# EAGLE design untitled (EAGLE 9.6.2)
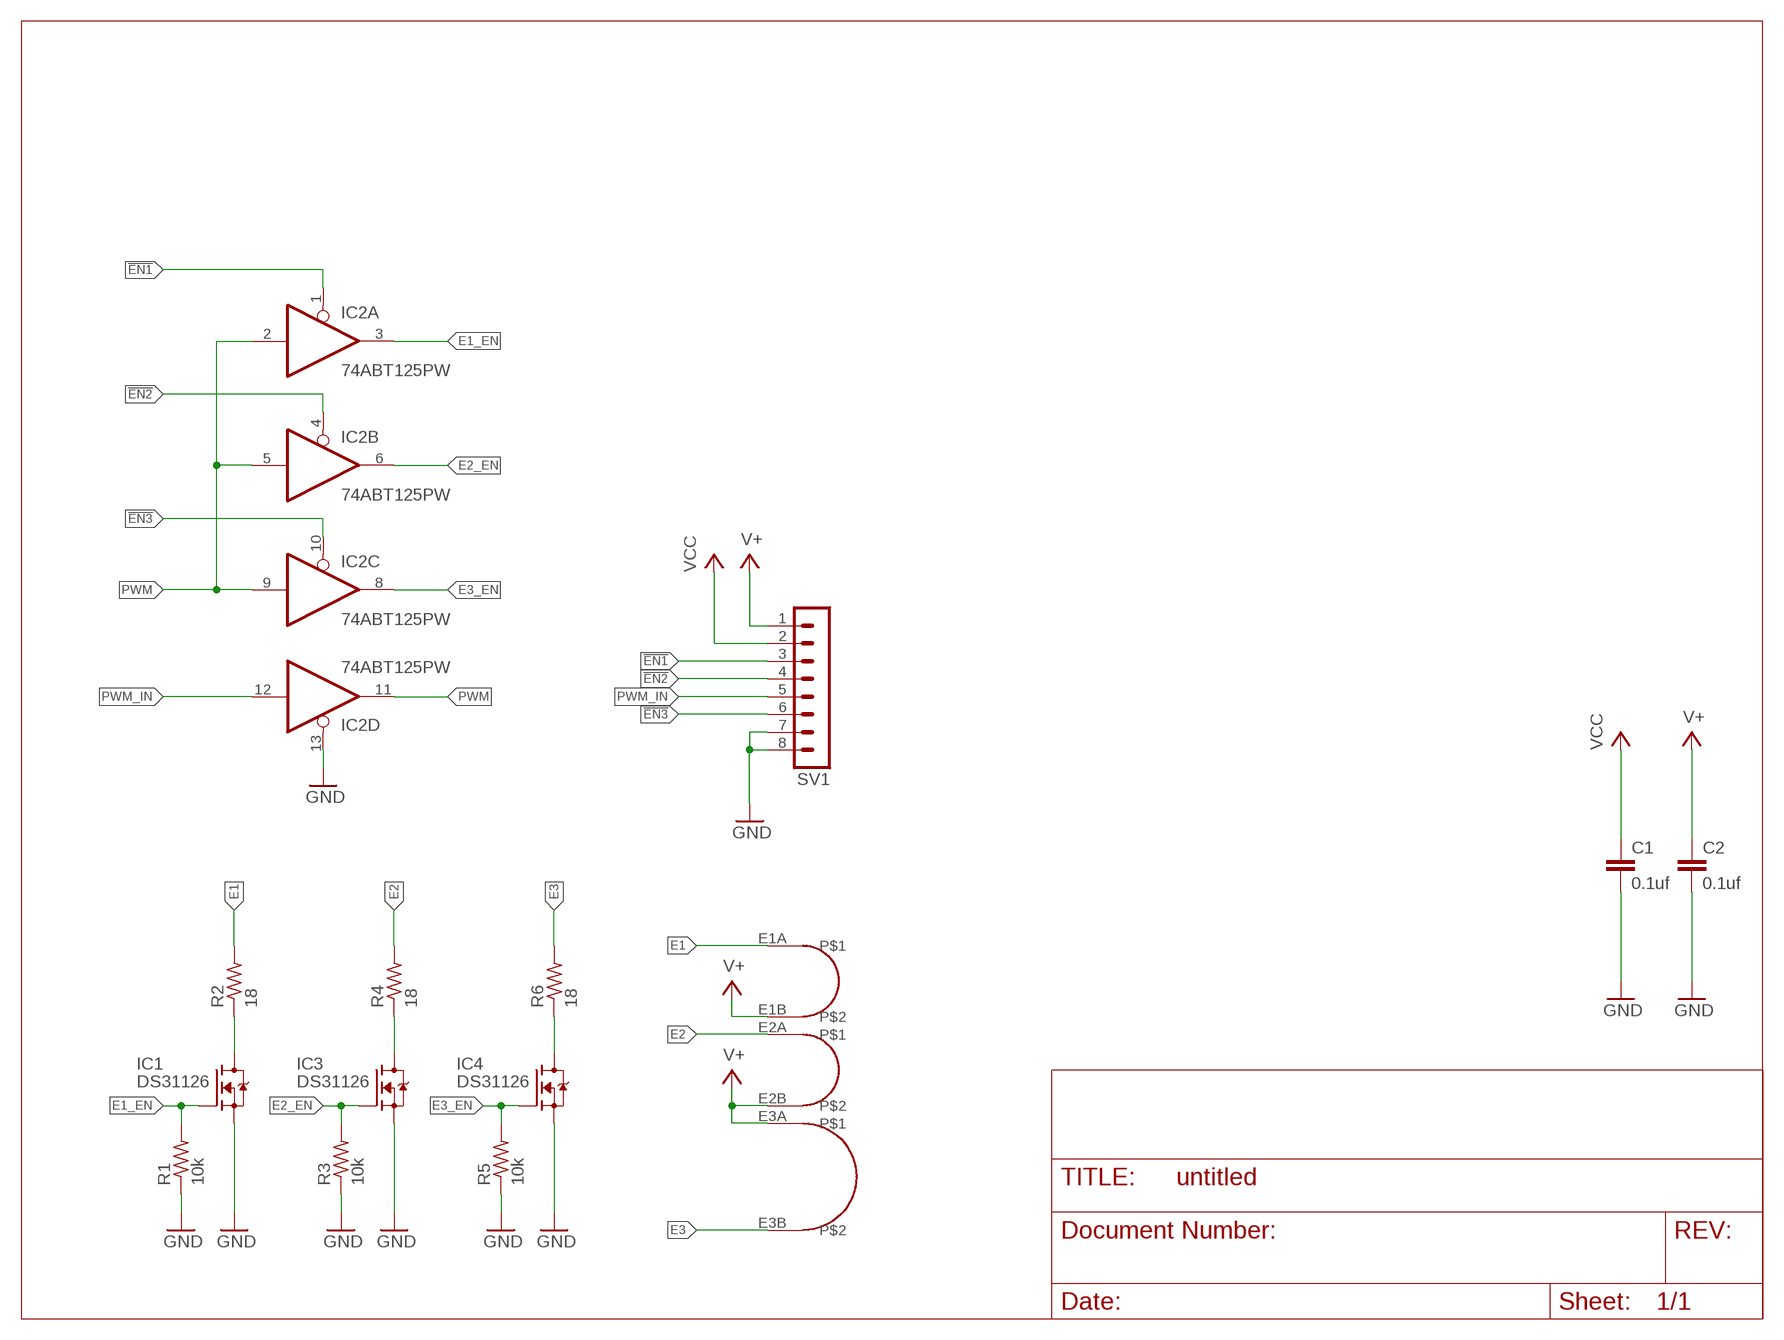
[diagram p0: schematic, sheet 1]

## Parts
C1  0.1uf  C-EUC0603  [C0603]
C2  0.1uf  C-EUC0603  [C0603]
IC1  DS31126  [SOT23]
IC2  74ABT125PW  [TSSOP14]
IC3  DS31126  [SOT23]
IC4  DS31126  [SOT23]
NICR1  HOT_WIRE  [LAYOUT_A]
R1  10k  R-US_R0603  [R0603]
R2  18  R-US_R2512W  [R2512W]
R3  10k  R-US_R0603  [R0603]
R4  18  R-US_R2512W  [R2512W]
R5  10k  R-US_R0603  [R0603]
R6  18  R-US_R2512W  [R2512W]
SV1  MA08-1  [MA08-1]

## Nets
!EN1: IC2.1(A:OE) SV1.3
!EN2: IC2.4(B:OE) SV1.4
!EN3: IC2.10(C:OE) SV1.6
E1: NICR1.E1A R2.2
E1_EN: IC1.G IC2.3(A:O) R1.2
E2: NICR1.E2A R4.2
E2_EN: IC2.6(B:O) IC3.G R3.2
E3: NICR1.E3B R6.2
E3_EN: IC2.8(C:O) IC4.G R5.2
GND: C1.2 C2.2 IC1.S IC2.13(D:OE) IC3.S IC4.S R1.1 R3.1 R5.1 SV1.7 SV1.8
N$1: IC1.D R2.1
N$2: IC3.D R4.1
N$3: IC4.D R6.1
PWM: IC2.2(A:I) IC2.5(B:I) IC2.9(C:I) IC2.11(D:O)
PWM_IN: IC2.12(D:I) SV1.5
V+: C2.1 NICR1.E1B NICR1.E2B NICR1.E3A SV1.1
VCC: C1.1 SV1.2

## Power pins joined to a net without a drawn wire
GND: IC2.7(P:GND)
VCC: IC2.14(P:VCC)

## Library data of the parts
C1 C2 = rcl:C-EU: CAPACITOR, European symbol; SPICEPREFIX: C
IC1 IC3 IC4 = ds31126:DS31126
IC2 = 74xx-eu:74*125: Quad bus BUFFER, 3-state
NICR1 = logo_wire:HOT_WIRE
R1-R6 = rcl:R-US_: RESISTOR, American symbol; SPICEPREFIX: R
SV1 = con-lstb_mod:MA08-1: PIN HEADER; OC_FARNELL: unknown; OC_NEWARK: unknown

## Board
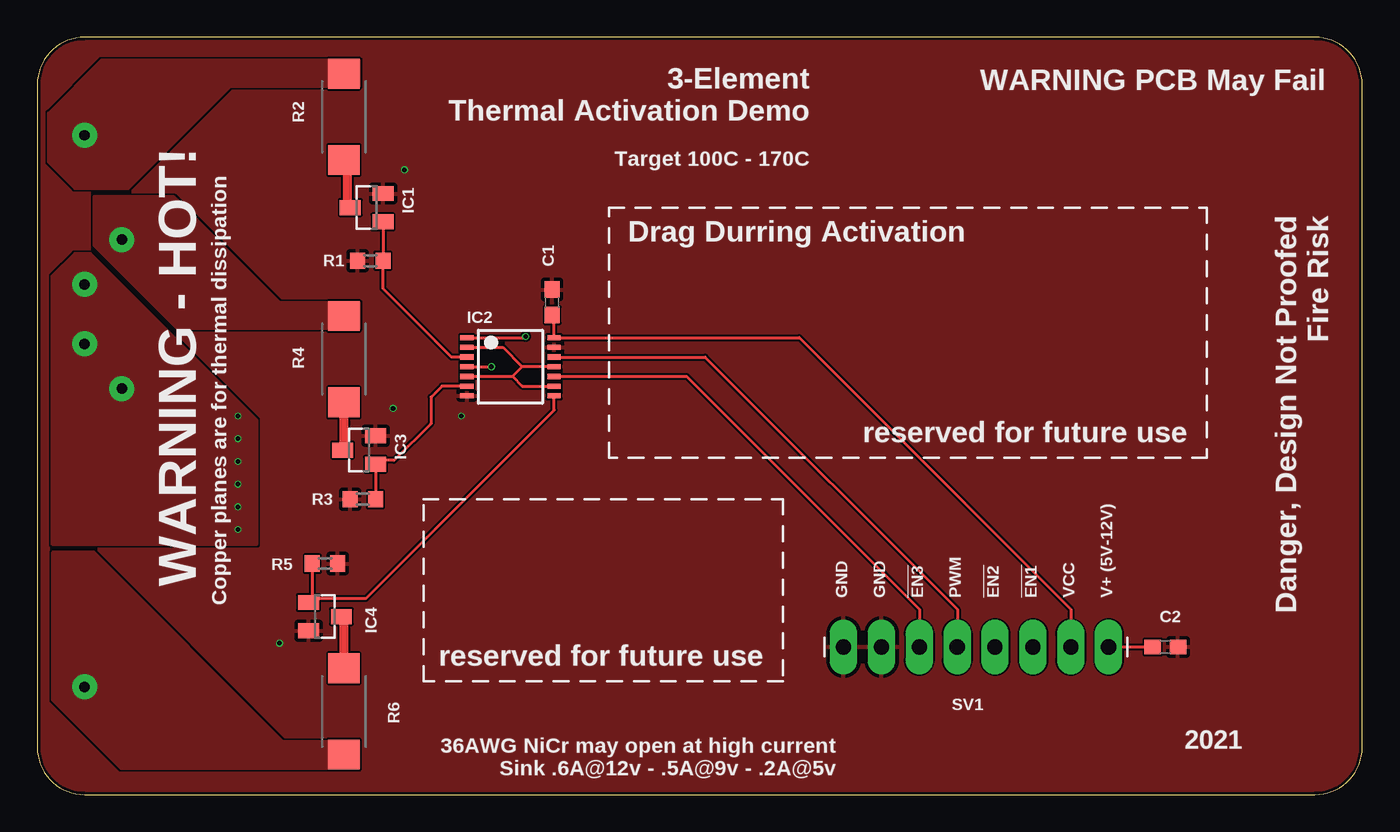
[diagram p1: board, top side]
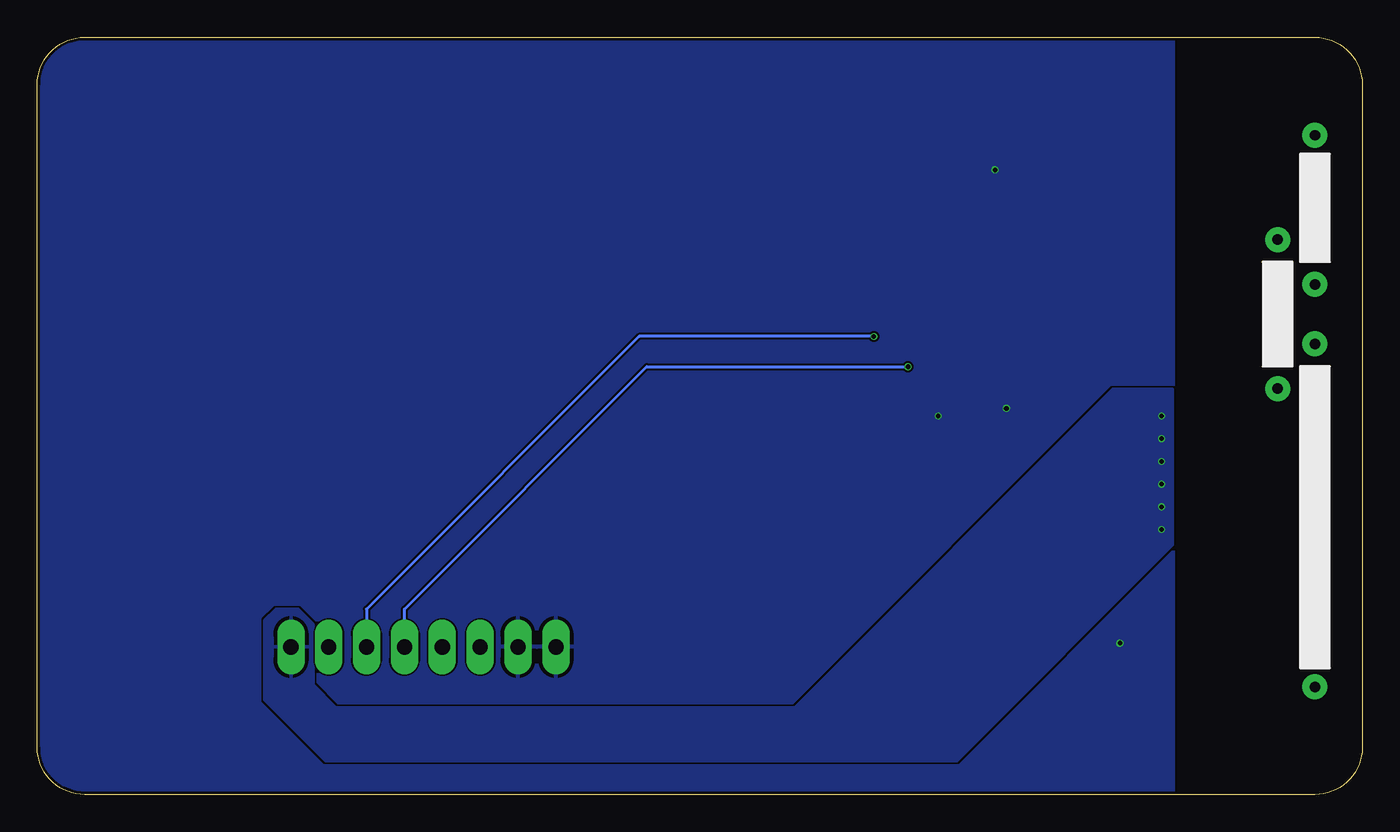
[diagram p2: board, bottom side, seen from below]

Size 88.9 x 50.8 mm. Coordinates in mm from the lower left corner, seen from the top.
Outline: 0,47.62 0,3.17 arc90 3.17,0 85.72,0 arc90 88.9,3.17 88.9,47.62 arc90 85.72,50.8 3.17,50.8 arc90 0,47.62
Copper layers (1*16): Top 0.035mm / dielectric 1.6mm / Bottom 0.035mm
Design rules "jlcpcb-2layers_tinted_vias": minimum track width 5mil, minimum drill 0.3mm, track to track 5mil, track to pad 5mil, pad to pad 5mil, via to via 5mil, smd to smd 5mil, copper to edge 0.2mm, drill to drill 6mil, minimum pad ring 10mil, minimum via ring 3mil, stop-mask expansion 4mil, vias tented up to drill 20mil, thermal gap 10mil
bKeepout: area 0,0 to 12.7,50.8

### Footprints (pad centres in the part's own frame; a part is rotated, then mirrored left to right if it is on the bottom)
C0603 = smd 1.1 x 1: 1 -0.85,0; 2 0.85,0
SOT23 = smd 1 x 1.4: D 0,1.1; G -0.95,-1.1; S 0.95,-1.1
TSSOP14 = smd 0.35 x 0.9: 1 -1.95,-2.925; 2 -1.3,-2.925; 3 -0.65,-2.925; 4 0,-2.925; 5 0.65,-2.925; 6 1.3,-2.925; 7 1.95,-2.925; 8 1.95,2.925; 9 1.3,2.925; 10 0.65,2.925; 11 0,2.925; 12 -0.65,2.925; 13 -1.3,2.925; 14 -1.95,2.925
LAYOUT_A = drill 0.7 pad 1.676: E1A 0,13.75; E1B 0,3.75; E2A 2.5,6.75; E2B 2.5,-3.25; E3A 0,-0.25; E3B 0,-23.25
R0603 = smd 1 x 1.1: 1 -0.85,0; 2 0.85,0
R2512W = smd 2 x 2.1: 1 -2.896,0; 2 2.896,0
MA08-1 = drill 1.016 long: 1 -8.89,0; 2 -6.35,0; 3 -3.81,0; 4 -1.27,0; 5 1.27,0; 6 3.81,0; 7 6.35,0; 8 8.89,0

### Placement (x,y rotation side)
C1  34.54,33.02 90 top
C2  75.69,9.91 0 top
IC1  DMN3150L-7  [SOT23]  22.1,39.37 90 top
IC2  31.75,28.7 270 top
IC3  DMN3150L-7  [SOT23]  21.59,23.11 90 top
IC4  DMN3150L-7  [SOT23]  19.3,11.94 270 top
NICR1  3.17,30.48 0 top
R1  22.35,35.81 0 top
R2  20.57,45.47 90 top
R3  21.84,19.81 0 top
R4  20.57,29.21 90 top
R5  19.3,15.49 180 top
R6  20.57,5.59 270 top
SV1  62.99,9.91 180 top

### Tracks (layer width: path | path; a pad name or v marks a point on that pad's centre or on a via)
!EN1  (via drill 0.3)
  Top 0.203: v32.77,30.73 32.68,30.65 IC2.1
  Bottom 0.203: v32.77,30.73 48.51,30.73 66.8,12.45 SV1.3
!EN2  (via drill 0.3)
  Top 0.203: IC2.4 v30.48,28.7
  Bottom 0.203: SV1.4 64.26,12.45 48.01,28.7 v30.48,28.7
!EN3
  Top 0.203: SV1.6 59.18,12.45 43.58,28.05 IC2.10
E1
  pour Top (rank 3, no thermals): 0.76,45.72 4.32,49.28 21.59,49.28 21.59,47.5 12.95,47.5 6.1,40.64 2.54,40.64 0.76,42.42
E1_EN
  Top 0.203: IC1.G R1.2 23.2,33.95 27.8,29.35 IC2.3
E2
  pour Top (rank 3, no thermals): 3.81,40.13 9.14,40.13 16.26,33.02 21.59,33.02 21.59,31.24 9.4,31.24 3.81,36.83
E2_EN
  Top 0.203: R3.2 IC3.G 22.94,22.42 23.94,22.42 26.42,24.89 26.42,26.67 27.15,27.4 IC2.6
E3
  pour Top (rank 3, no thermals): 1.02,16.26 1.02,6.35 5.59,1.78 21.59,1.78 21.59,3.56 16.51,3.56 3.81,16.26
E3_EN
  Top 0.203: R5.2 18.45,13.14 IC4.G 18.46,13.14 22.03,13.14 34.67,25.79 IC2.8
GND  (via drill 0.3)
  other vias: 16.26,10.16 23.88,25.91 28.45,25.4 24.64,41.91
  pour Bottom (rank 5): 12.7,50.8 12.7,0 85.72,0 arc90 88.9,3.17 88.9,47.62 arc90 85.72,50.8
  pour Top (rank 5): 0,50.8 0,0 85.72,0 arc90 88.9,3.17 88.9,47.62 arc90 85.72,50.8
N$1
  Top 0.61: IC1.D 20.83,39.54 20.83,42.57 R2.1
N$2
  Top 0.61: IC3.D 20.57,23.2 R4.1
N$3
  Top 0.61: R6.1 20.57,11.51 IC4.D
PWM
  Top 0.203: IC2.5 31.89,28.05 | IC2.9 32.54,27.4 31.89,28.05 | IC2.11 32.54,28.7 | 32.54,28.7 31.89,28.05 | IC2.2 31.24,30 32.54,28.7
PWM_IN
  Top 0.203: SV1.5 61.72,12.45 44.82,29.35 IC2.12
V+  (via drill 0.3)
  Top 0.203: SV1.1 C2.1
  other vias: 13.46,25.4 13.46,23.88 13.46,22.35 13.46,20.83 13.46,19.3 13.46,17.78
  pour Top (rank 3, no thermals): 2.54,36.32 3.56,36.32 14.73,25.15 14.73,16.76 1.02,16.76 1.02,34.8
  pour Bottom (rank 3): 70.36,11.43 71.37,12.45 72.9,12.45 73.66,11.68 73.66,6.35 69.6,2.29 27.18,2.29 12.7,16.76 12.7,27.18 16.76,27.18 38.1,5.84 68.83,5.84 70.36,7.37
VCC
  Top 0.203: SV1.2 69.34,12.45 51.14,30.65 IC2.14 34.67,32.04 C1.1

### Text on the board
tPlace: 3-Element / Thermal Activation Demo | WARNING PCB May Fail | Target 100C - 170C | Danger, Design Not Proofed / Fire Risk | Drag Durring Activation | reserved for future use | WARNING - HOT! | Copper planes are for thermal dissipation | GND | GND | !EN3 | PWM | !EN2 | !EN1 | VCC | V+ (5V-12V) | reserved for future use | 36AWG NiCr may open at high current / Sink .6A@12v - .5A@9v - .2A@5v | 2021